# Altium schematic sheet M.2_NVME_CON.SchDoc
size 420 x 297 mm; SheetNumber: 9; SheetTotal: 11; ModifiedBy: -; CheckedDate: -; Title2: Title 2; DivGrp: WUT ISE; Designer: G.Kasprowicz
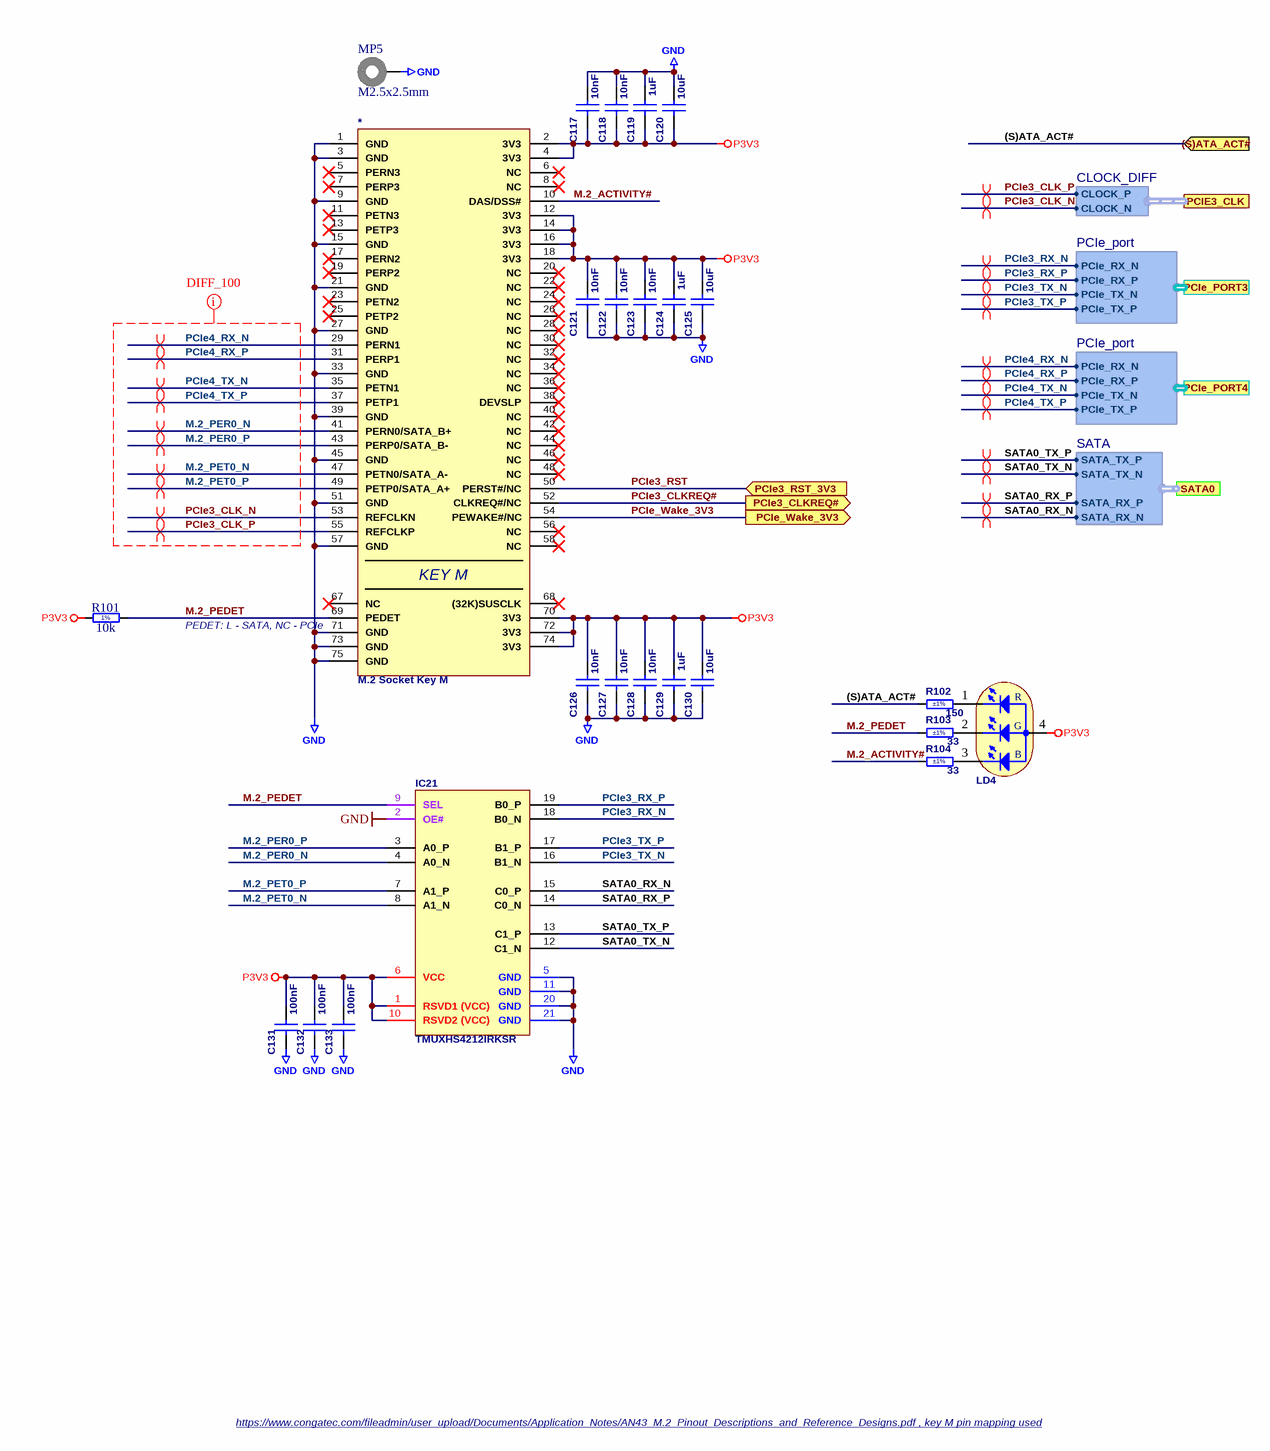
[diagram p0: M.2_NVME_CON.SchDoc]

## Parts
*  M.2 Socket Key M  [FP-1-2199230-6-MFG]
C117  10nF  [CAPC1005X55N]
C118  10nF  [CAPC1005X55N]
C119  1uF  [CAPC1005X55N]
C120  10uF  [CAPC1608X80N]
C121  10nF  [CAPC1005X55N]
C122  10nF  [CAPC1005X55N]
C123  10nF  [CAPC1005X55N]
C124  1uF  [CAPC1005X55N]
C125  10uF  [CAPC1608X80N]
C126  10nF  [CAPC1005X55N]
C127  10nF  [CAPC1005X55N]
C128  10nF  [CAPC1005X55N]
C129  1uF  [CAPC1005X55N]
C130  10uF  [CAPC1608X80N]
C131  100nF  [CAPC1005X55N]
C132  100nF  [CAPC1005X55N]
C133  100nF  [CAPC1005X55N]
IC21  TMUXHS4212IRKSR  [TI_RKS0020A]
LD4  Red/Green/Blue  [LED_OPTEK_OVSRRGBCC3_a]  (value not drawn)
MP5  M2.5x2.5mm  [9774025151]
R101  10k  [RESC1005X40N]
R102  150  Tolerance: ±1%  [RESC1005X40N]
R103  33  Tolerance: ±1%  [RESC1005X40N]
R104  33  Tolerance: ±1%  [RESC1005X40N]

## Ports
(S)ATA_ACT# (in), PCIE3_CLK (harness CLOCK_DIFF), PCIe3_CLKREQ# (out), PCIe3_RST_3V3 (in), PCIe_PORT3 (harness PCIe_port), PCIe_PORT4 (harness PCIe_port), PCIe_Wake_3V3 (out), SATA0 (harness SATA)

## Harnesses
PCIe_port: PCIe_TX_P, PCIe_TX_N, PCIe_RX_P, PCIe_RX_N
CLOCK_DIFF: CLOCK_P, CLOCK_N
SATA: SATA_TX_N, SATA_TX_P, SATA_RX_N, SATA_RX_P

## Nets
GND: *.1(GND) *.3(GND) *.9(GND) *.15(GND) *.21(GND) *.27(GND) *.33(GND) *.39(GND) *.45(GND) *.51(GND) *.57(GND) *.71(GND) *.73(GND) *.75(GND) C117.2 C118.2 C119.2 C120.2 C121.1 C122.1 C123.1 C124.1 C125.1 C126.1 C127.1 C128.1 C129.1 C130.1 C131.1 C132.1 C133.1 IC21.2(OE#) IC21.5(GND) IC21.11(GND) IC21.20(GND) IC21.21(GND) MP5.1
P3V3: *.2(3V3) *.4(3V3) *.12(3V3) *.14(3V3) *.16(3V3) *.18(3V3) *.70(3V3) *.72(3V3) *.74(3V3) C117.1 C118.1 C119.1 C120.1 C121.2 C122.2 C123.2 C124.2 C125.2 C126.2 C127.2 C128.2 C129.2 C130.2 C131.2 C132.2 C133.2 IC21.1(RSVD1_(VCC)) IC21.6(VCC) IC21.10(RSVD2_(VCC)) LD4.4(CC) R101.1
(S)ATA_ACT#: R102.1 ; port (S)ATA_ACT#
M.2_ACTIVITY#: *.10(DAS/DSS#) R104.1
M.2_PEDET: *.69(PEDET) IC21.9(SEL) R101.2 R103.1
M.2_PER0_N: *.41(PERN0/SATA_B+) IC21.4(A0_N)
M.2_PER0_P: *.43(PERP0/SATA_B-) IC21.3(A0_P)
M.2_PET0_N: *.47(PETN0/SATA_A-) IC21.8(A1_N)
M.2_PET0_P: *.49(PETP0/SATA_A+) IC21.7(A1_P)
PCIe3_CLK_N: *.53(REFCLKN) ; port PCIE3_CLK.CLOCK_N
PCIe3_CLK_P: *.55(REFCLKP) ; port PCIE3_CLK.CLOCK_P
PCIe3_CLKREQ#: *.52(CLKREQ#/NC) ; port PCIe3_CLKREQ#
PCIe3_RST: *.50(PERST#/NC) ; port PCIe3_RST_3V3
PCIe3_RX_N: IC21.18(B0_N) ; port PCIe_PORT3.PCIe_RX_N
PCIe3_RX_P: IC21.19(B0_P) ; port PCIe_PORT3.PCIe_RX_P
PCIe3_TX_N: IC21.16(B1_N) ; port PCIe_PORT3.PCIe_TX_N
PCIe3_TX_P: IC21.17(B1_P) ; port PCIe_PORT3.PCIe_TX_P
PCIe4_RX_N: *.29(PERN1) ; port PCIe_PORT4.PCIe_RX_N
PCIe4_RX_P: *.31(PERP1) ; port PCIe_PORT4.PCIe_RX_P
PCIe4_TX_N: *.35(PETN1) ; port PCIe_PORT4.PCIe_TX_N
PCIe4_TX_P: *.37(PETP1) ; port PCIe_PORT4.PCIe_TX_P
PCIe_Wake_3V3: *.54(PEWAKE#/NC) ; port PCIe_Wake_3V3
SATA0_RX_N: IC21.15(C0_P) ; port SATA0.SATA_RX_N
SATA0_RX_P: IC21.14(C0_N) ; port SATA0.SATA_RX_P
SATA0_TX_N: IC21.12(C1_N) ; port SATA0.SATA_TX_N
SATA0_TX_P: IC21.13(C1_P) ; port SATA0.SATA_TX_P
NetLD4_1: LD4.1(AR) R102.2
NetLD4_2: LD4.2(AG) R103.2
NetLD4_3: LD4.3(AB) R104.2

Not connected (* = marked no-connect by the designer): * 5(PERN3)* 6(NC)* 7(PERP3)* 8(NC)* 11(PETN3)* 13(PETP3)* 17(PERN2)* 19(PERP2)* 20(NC)* 22(NC)* 23(PETN2)* 24(NC)* 25(PETP2)* 26(NC)* 28(NC)* 30(NC)* 32(NC)* 34(NC)* 36(NC)* 38(DEVSLP)* 40(NC)* 42(NC)* 44(NC)* 46(NC)* 48(NC)* 56(NC)* 58(NC)* 67(NC)* 68((32K)SUSCLK)*

## Layout directives
net class DIFF_100: M.2_PER0_N, M.2_PER0_P, M.2_PET0_N, M.2_PET0_P, PCIe3_CLK_N, PCIe3_CLK_P, PCIe4_RX_N, PCIe4_RX_P, PCIe4_TX_N, PCIe4_TX_P
differential pair: M.2_PER0_N, M.2_PER0_P, M.2_PET0_N, M.2_PET0_P, PCIe3_CLK_N, PCIe3_CLK_P, PCIe3_RX_N, PCIe3_RX_P, PCIe3_TX_N, PCIe3_TX_P, PCIe4_RX_N, PCIe4_RX_P, PCIe4_TX_N, PCIe4_TX_P, SATA0_RX_N, SATA0_RX_P, SATA0_TX_N, SATA0_TX_P

## Notes on the sheet
- (near *) PEDET: L - SATA, NC - PCIe
- https://www.congatec.com/fileadmin/user_upload/Documents/Application_Notes/AN43_M.2_Pinout_Descriptions_and_Reference_Designs.pdf , key M pin mapping used
- Project/Equipment
- Document
- Designer
- Drawn by
- Check.by
- Copyright WUT ISE 2024.
  This documentation describes Open Hardware and is licensed under the CERN OHL v.2. You may redistribute and modify this documentation under the terms of the CERN OHL v.2. (http://ohwr.org/CERNOHL). This documentation is distributed WITHOUT ANY EXPRESS OR IMPLIED WARRANTY, INCLUDING OF MERCHANTABILITY, SATISFACTORY QUALITY AND FITNESS FOR A PARTICULAR PURPOSE. Please see the CERN OHL v.2 for applicable conditions.
- Contact
- File
- Last Mod.
- Print Date
- Sheet
- Size
- A3
- of
- Rev
- (in symbol LED_OPTEK_OVSRRGBCC3_a) R; G; B
- (in symbol M.2 Socket Key M) KEY M
- (in symbol R0402_10K_1%_0.0625W_100PPM) 1%

## Library data of the parts
C117 C118 C121-C123 C126-C128 = CC0402_10NF_16V_10%_X7R: Non-polarised capacitor; Part Description: SMD Multilayer Chip Ceramic Capacitor; Manufacturer: GENERIC; Manufacturer1 Part Number: 223878715636; Voltage: 16V; TC: X7R; Tolerance: ±10%; Part Number: CC0402_10NF_16V_10%_X7R; Component Kind: Standard; Component Type: Standard; Pin Count: 2; Value: 10nF; Status: Not Recommended; Manufacturer Part Number: CC0402_10NF_16V_10%_X7R; Case: 0402; Mounted: Yes; Socket: No; SMD: Yes; Sense: No; Manufacturer1 Example: PHYCOMP; Manufacturer1 ComponentHeight: 0.55mm; HelpURL: \\cern.ch\dfs\Applications\Altium\Datasheets\CC0402_X7R_PHYCOMP.pdf; Author: CERN DEM JLC; CreateDate: 03.12.2007; LatestRevisionDate: 03.12.2007
C119 C124 C129 = CC0402_1UF_16V_10%_X5R: Non-polarised capacitor; Part Description: SMD Multilayer Chip Ceramic Capacitor; Manufacturer: GENERIC; Manufacturer1 Part Number: C1005X5R1C105KT; Voltage: 16V; TC: X5R; Tolerance: ±10%; Part Number: CC0402_1UF_16V_10%_X5R; Component Kind: Standard; Component Type: Standard; Pin Count: 2; Value: 1uF; Status: Preferred; Manufacturer Part Number: CC0402_1UF_16V_10%_X5R; Case: 0402; Mounted: Yes; Socket: No; SMD: Yes; Sense: No; Manufacturer1 Example: TDK; Manufacturer1 ComponentHeight: 0.55mm; HelpURL: \\cern.ch\dfs\Applications\Altium\Datasheets\CC0402_X5R_TDK_C.pdf; Author: CERN DEM JLC; CreateDate: 2012-10-25; LatestRevisionDate: 2012-10-25
C120 C125 C130 = CC0603_10UF_16V_20%_X5R: Non-polarised capacitor; Part Description: SMD Multilayer Chip Ceramic Capacitor; Manufacturer: GENERIC; Manufacturer1 Part Number: GRM188R61C106MA73D; Voltage: 16V; TC: X5R; Tolerance: ±20%; Part Number: CC0603_10UF_16V_20%_X5R; Component Kind: Standard; Component Type: Standard; Pin Count: 2; Value: 10uF; Status: None; Manufacturer Part Number: CC0603_10UF_16V_20%_X5R; Case: 0603; Mounted: Yes; Socket: No; SMD: Yes; Sense: No; Manufacturer1 Example: MURATA; Manufacturer1 ComponentHeight: 0.8mm; HelpURL: \\cern.ch\dfs\Applications\Altium\Datasheets\CC0603_X5R_MURATA_GRM.pdf; Author: CERN DEM MR; CreateDate: 02.03.2016; LatestRevisionDate: 02.03.2016
C131-C133 = CC0402_100NF_16V_10%_X7R: Non-polarised capacitor; Part Description: SMD Multilayer Chip Ceramic Capacitor; Manufacturer: GENERIC; Manufacturer1 Part Number: GRM155R71C104KA88D; Voltage: 16V; TC: X7R; Tolerance: ±10%; Part Number: CC0402_100NF_16V_10%_X7R; Component Kind: Standard; Component Type: Standard; Pin Count: 2; Value: 100nF; Status: Not Recommended; Manufacturer Part Number: CC0402_100NF_16V_10%_X7R; Case: 0402; Mounted: Yes; Socket: No; SMD: Yes; Sense: No; Manufacturer1 Example: MURATA; Manufacturer1 ComponentHeight: 0.55mm; HelpURL: \\cern.ch\dfs\Applications\Altium\Datasheets\CC0402_X7R_MURATA_GRM.pdf; Author: CERN DEM JLC; CreateDate: 05/12/2013; LatestRevisionDate: 03/12/2007
IC21 = TMUXHS4212: Two-Channel Differential 2:1 MUX or 1:2 Demux
LD4 = LED_OPTEK_OVSRRGBCC3_a: Right Angle Tricolor (RGB) Surface Mount LED, Body 3.2x1mm; Part Description: Side Mount, Full-Color (RGB), 1204 Surface Mount LED (150° Viewing Angle); Manufacturer: OPTEK / TT ELECTRONICS; PressFit: No; Bonding: No; Part Number: LED_OPTEK_OVSRRGBCC3_a; Component Kind: Standard; Component Type: Standard; Color: Red/Green/Blue; PackageDescription: Side Mount, Full-Color (RGB), 1204 Surface Mount LED (150° Viewing Angle); Manufacturer Part Number: OVSRRGBCC3; Pin Count: 4; Case: 1204; Mounted: Yes; Socket: No; SMD: Yes; Sense: No; ComponentHeight: 1mm; HelpURL: \\cern.ch\dfs\Applications\Altium\Datasheets\LED_OPTEK_OVSRRGBCC3.pdf; Author: CERN DEM JLC; CreateDate: 09.08.2011; LatestRevisionDate: 09.08.2011
MP5 = 9774025151: WA-SMSI SMT Steel Spacer, internal Thread, OD 5.1mm, M2.5x2.5mm; Manufacturer: Wurth Elektronik; Inner Diameter: 3.5mm; Surface: Tin; Thread: M2.5; ComponentLink1Description: Manufacturer; ComponentLink1URL: http://www.we-online.de; ComponentLink2Description: Datasheet; ComponentLink2URL: https://www.we-online.com/catalog/datasheet/9774025151.pdf; Mounting Technology: SMT; Packaging: Bulk; Manufacturer Part Number: 9774025151; Length: 2.5mm; Inner Thread Length: -; Operating Temperature: -55 to +150degC; Outer Diameter: 5.1mm; Published Date: April 2020; Material: Steel
R101 = R0402_10K_1%_0.0625W_100PPM: Resistor - 1%; Part Description: General Purpose Thick Film Chip Resistor; Manufacturer: GENERIC; Manufacturer1 Part Number: 232270671003L; TC: ±100ppm/°C; Table: Resistors SMD; Part Number: R0402_10K_1%_0.0625W_100PPM; Component Kind: Standard; Component Type: Standard; Pin Count: 2; Value: 10k; Status: Not recommended; Power: 0.0625W; Tolerance: ±1%; Manufacturer Part Number: R0402_10K_1%_0.0625W_100PPM; Case: 0402; Mounted: Yes; Socket: No; SMD: Yes; Manufacturer1 Example: YAGEO PHYCOMP; Manufacturer1 ComponentHeight: 0.4mm; HelpURL: \\cern.ch\dfs\Applications\Altium\Datasheets\R0402_Phycomp_RC0402.pdf; Author: CERN DEM JLC; CreateDate: 2007-12-03; LatestRevisionDate: 2012-10-17
R102 = R0402_150R_1%_0.0625W_100PPM: Resistor - 1%; Part Description: General Purpose Thick Film Chip Resistor; Manufacturer: GENERIC; Manufacturer1 Part Number: 232270671501L; TC: ±100ppm/°C; PressFit: No; Part Number: R0402_150R_1%_0.0625W_100PPM; Component Kind: Standard; Component Type: Standard; Pin Count: 2; Value: 150; Status: Not Recommended; Power: 0.0625W; Manufacturer Part Number: R0402_150R_1%_0.0625W_100PPM; Case: 0402; Mounted: Yes; Sense: No; Socket: No; SMD: Yes; Manufacturer1 Example: YAGEO PHYCOMP; Manufacturer1 ComponentHeight: 0.4mm; HelpURL: \\cern.ch\dfs\Applications\Altium\Datasheets\R0402_Phycomp_RC0402.pdf; Author: CERN DEM JLC; CreateDate: 03.12.2007; LatestRevisionDate: 17.10.2012
R103 R104 = R0402_33R_1%_0.0625W_100PPM: Resistor - 1%; Part Description: General Purpose Thick Film Chip Resistor; Manufacturer: GENERIC; Manufacturer1 Part Number: 232270673309L; TC: ±100ppm/°C; PressFit: No; Part Number: R0402_33R_1%_0.0625W_100PPM; Component Kind: Standard; Component Type: Standard; Pin Count: 2; Value: 33; Status: Not Recommended; Power: 0.0625W; Manufacturer Part Number: R0402_33R_1%_0.0625W_100PPM; Case: 0402; Mounted: Yes; Sense: No; Socket: No; SMD: Yes; Manufacturer1 Example: YAGEO PHYCOMP; Manufacturer1 ComponentHeight: 0.4mm; HelpURL: \\cern.ch\dfs\Applications\Altium\Datasheets\R0402_Phycomp_RC0402.pdf; Author: CERN DEM JLC; CreateDate: 03.12.2007; LatestRevisionDate: 17.10.2012